# EAGLE design FAL65816_ram (EAGLE 7.2.0)
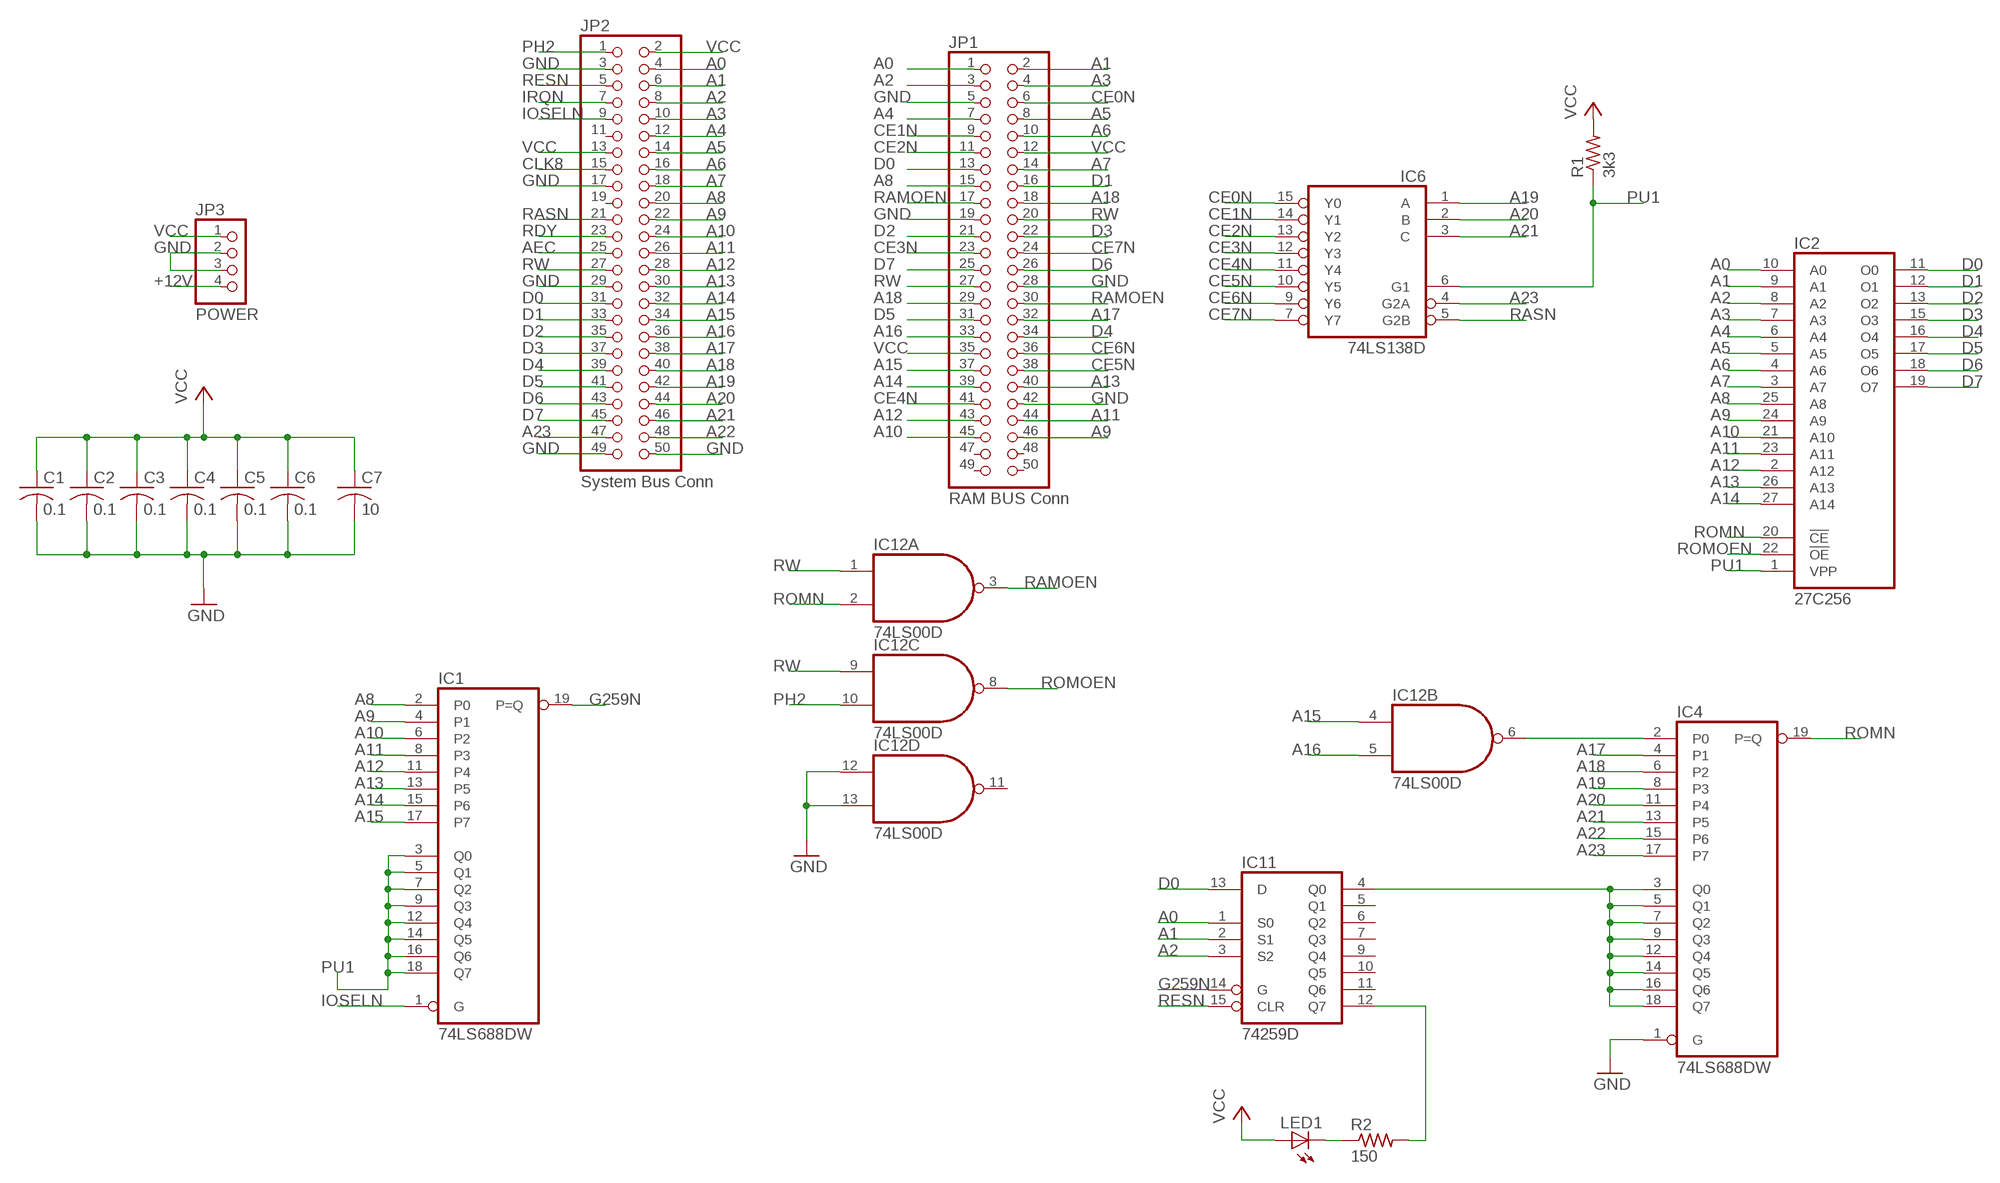
[diagram p0: schematic, sheet 1]

## Parts
C1  0.1  C-US050-024X044  [C050-024X044]
C2  0.1  C-US050-024X044  [C050-024X044]
C3  0.1  C-US050-024X044  [C050-024X044]
C4  0.1  C-US050-024X044  [C050-024X044]
C5  0.1  C-US050-024X044  [C050-024X044]
C6  0.1  C-US050-024X044  [C050-024X044]
C7  10  C-US050-024X044  [C050-024X044]
IC1  74LS688DW  [SO20W]
IC2  27C256  27256  [DIL28]
IC4  74LS688DW  [SO20W]
IC6  74LS138D  [SO16]
IC11  74259D  [SO16]
IC12  74LS00D  [SO14]
JP1  RAM BUS Conn  PINHD-2X25/90  [2X25/90]
JP2  System Bus Conn  PINHD-2X25/90  [2X25/90]
JP3  POWER  PINHD-1X4/90  [1X04/90]
LED1  LED5MM  [LED5MM]
R1  3k3  R-US_0204/7  [0204/7]
R2  150  R-US_0204/7  [0204/7]

## Nets
+12V: JP3.4
A0: IC2.10(A0) IC11.1(S0) JP1.1 JP2.4
A1: IC2.9(A1) IC11.2(S1) JP1.2 JP2.6
A2: IC2.8(A2) IC11.3(S2) JP1.3 JP2.8
A3: IC2.7(A3) JP1.4 JP2.10
A4: IC2.6(A4) JP1.7 JP2.12
A5: IC2.5(A5) JP1.8 JP2.14
A6: IC2.4(A6) JP1.10 JP2.16
A7: IC2.3(A7) JP1.14 JP2.18
A8: IC1.2(P0) IC2.25(A8) JP1.15 JP2.20
A9: IC1.4(P1) IC2.24(A9) JP1.46 JP2.22
A10: IC1.6(P2) IC2.21(A10) JP1.45 JP2.24
A11: IC1.8(P3) IC2.23(A11) JP1.44 JP2.26
A12: IC1.11(P4) IC2.2(A12) JP1.43 JP2.28
A13: IC1.13(P5) IC2.26(A13) JP1.40 JP2.30
A14: IC1.15(P6) IC2.27(A14) JP1.39 JP2.32
A15: IC1.17(P7) IC12.4(B:I0) JP1.37 JP2.34
A16: IC12.5(B:I1) JP1.33 JP2.36
A17: IC4.4(P1) JP1.32 JP2.38
A18: IC4.6(P2) JP1.18 JP1.29 JP2.40
A19: IC4.8(P3) IC6.1(A) JP2.42
A20: IC4.11(P4) IC6.2(B) JP2.44
A21: IC4.13(P5) IC6.3(C) JP2.46
A22: IC4.15(P6) JP2.48
A23: IC4.17(P7) IC6.4(G2A) JP2.47
AEC: JP2.25
CE0N: IC6.15(Y0) JP1.6
CE1N: IC6.14(Y1) JP1.9
CE2N: IC6.13(Y2) JP1.11
CE3N: IC6.12(Y3) JP1.23
CE4N: IC6.11(Y4) JP1.41
CE5N: IC6.10(Y5) JP1.38
CE6N: IC6.9(Y6) JP1.36
CE7N: IC6.7(Y7) JP1.24
CLK8: JP2.15
D0: IC2.11(O0) IC11.13(D) JP1.13 JP2.31
D1: IC2.12(O1) JP1.16 JP2.33
D2: IC2.13(O2) JP1.21 JP2.35
D3: IC2.15(O3) JP1.22 JP2.37
D4: IC2.16(O4) JP1.34 JP2.39
D5: IC2.17(O5) JP1.31 JP2.41
D6: IC2.18(O6) JP1.26 JP2.43
D7: IC2.19(O7) JP1.25 JP2.45
G259N: IC1.19(P=Q) IC11.14(G)
GND: C1.2 C2.2 C3.2 C4.2 C5.2 C6.2 C7.2 IC4.1(G) IC12.12(D:I0) IC12.13(D:I1) JP1.5 JP1.19 JP1.28 JP1.42 JP2.3 JP2.17 JP2.29 JP2.49 JP2.50 JP3.2 JP3.3
IOSELN: IC1.1(G) JP2.9
IRQN: JP2.7
N$1: IC4.3(Q0) IC4.5(Q1) IC4.7(Q2) IC4.9(Q3) IC4.12(Q4) IC4.14(Q5) IC4.16(Q6) IC4.18(Q7) IC11.4(Q0)
N$2: LED1.K(C) R2.1
N$3: IC11.12(Q7) R2.2
N$4: IC4.2(P0) IC12.6(B:O)
PH2: IC12.10(C:I1) JP2.1
PU1: IC1.3(Q0) IC1.5(Q1) IC1.7(Q2) IC1.9(Q3) IC1.12(Q4) IC1.14(Q5) IC1.16(Q6) IC1.18(Q7) IC2.1(VPP) IC6.6(G1) R1.1
RAMOEN: IC12.3(A:O) JP1.17 JP1.30
RASN: IC6.5(G2B) JP2.21
RDY: JP2.23
RESN: IC11.15(CLR) JP2.5
ROMN: IC2.20(!CE) IC4.19(P=Q) IC12.2(A:I1)
ROMOEN: IC2.22(!OE) IC12.8(C:O)
RW: IC12.1(A:I0) IC12.9(C:I0) JP1.20 JP1.27 JP2.27
VCC: C1.1 C2.1 C3.1 C4.1 C5.1 C6.1 C7.1 JP1.12 JP1.35 JP2.2 JP2.13 JP3.1 LED1.A R1.2
Unconnected: IC11.5(Q1) IC11.6(Q2) IC11.7(Q3) IC11.9(Q4) IC11.10(Q5) IC11.11(Q6) IC12.11(D:O) JP1.47 JP1.48 JP1.49 JP1.50 JP2.11 JP2.19

## Power pins joined to a net without a drawn wire
GND: IC1.10(GND) IC2.14(GND) IC4.10(GND) IC6.8(GND) IC11.8(GND) IC12.7(P:GND)
VCC: IC1.20(VCC) IC2.28(VCC) IC4.20(VCC) IC6.16(VCC) IC11.16(VCC) IC12.14(P:VCC)

## Library data of the parts
C1-C7 = rcl:C-US: CAPACITOR, American symbol
IC1 IC4 = FT74xx:74*688: 8-bit MAGNITUDE/IDENTITY COMPARATOR, totem pole
IC2 = memory:27256: MEMORY
IC6 = FT74xx:74*138: 3-line to 8-line DECODER/DEMULTIPLEXER
IC11 = 74xx-us:74*259: 8-bit addressable LATCH
IC12 = 74xx-us:74*00: Quad 2-input NAND gate
JP1 JP2 = pinhead:PINHD-2X25: PIN HEADER
JP3 = pinhead:PINHD-1X4: PIN HEADER
LED1 = led:LED: LED OSRAM: - CHIPLED LG R971, LG N971, LY N971, LG Q971, LY Q971, LO R971, LY R971 LH N974, LH R974 LS Q976, LO Q976, LY Q976 LO Q996 - Hyper CHIPLED LW Q18S LB Q993, LB Q99A, LB R99A - SideLED LS A670, LO A670, LY A670, LG A670, LP A670 LB A673, LV A673, LT A673, LW A673 LH A674 LY A675 LS A676, LA A676, LO A676, LY A676, LW A676 LS A679, LY A679, LG A679 - Hyper Micro SIDELED® LS Y876, LA Y876, LO Y876, LY Y876 LT Y87S - SmartLED LW L88C, LW L88S LB L89C, LB L89S, LG L890 LS L89K, LO L89K, LY L89K LS L896, LA L896, LO L896, LY L896 - TOPLED LS T670, LO T670, LY T670, LG T670, LP T670 LSG T670, LSP T670, LSY T670, LOP T670, LYG T670 LG T671, LOG T671, LSG T671 LB T673, LV T673, LT T673, LW T673 LH T674 LS T676, LA T676, LO T676, LY T676, LB T676, LH T676, LSB T676, LW T676 LB T67C, LV T67C, LT T67C, LS T67K, LO T67K, LY T67K, LW E67C LS E67B, LA E67B, LO E67B, LY E67B, LB E67C, LV E67C, LT E67C LW T67C LS T679, LY T679, LG T679 LS T770, LO T770, LY T770, LG T770, LP T770 LB T773, LV T773, LT T773, LW T773 LH T774 LS E675, LA E675, LY E675, LS T675 LS T776, LA T776, LO T776, LY T776, LB T776 LHGB T686 LT T68C, LB T68C - Hyper Mini TOPLED® LB M676 - Mini TOPLED Santana® LG M470 LS M47K, LO M47K, LY M47K Source: http://www.osram.convergy.de LUXEON: - LUMILED® LXK2-PW12-R00, LXK2-PW12-S00, LXK2-PW14-U00, LXK2-PW14-V00 LXK2-PM12-R00, LXK2-PM12-S00, LXK2-PM14-U00 LXK2-PE12-Q00, LXK2-PE12-R00, LXK2-PE12-S00, LXK2-PE14-T00, LXK2-PE14-U00 LXK2-PB12-K00, LXK2-PB12-L00, LXK2-PB12-M00, LXK2-PB14-N00, LXK2-PB14-P00, LXK2-PB14-Q00 LXK2-PR12-L00, LXK2-PR12-M00, LXK2-PR14-Q00, LXK2-PR14-R00 LXK2-PD12-Q00, LXK2-PD12-R00, LXK2-PD12-S00 LXK2-PH12-R00, LXK2-PH12-S00 LXK2-PL12-P00, LXK2-PL12-Q00, LXK2-PL12-R00 Source: www.luxeon.com KINGBRIGHT: KA-3528ASYC Source: www.kingbright.com
R1 R2 = resistor:R-US_: RESISTOR, American symbol

## Board
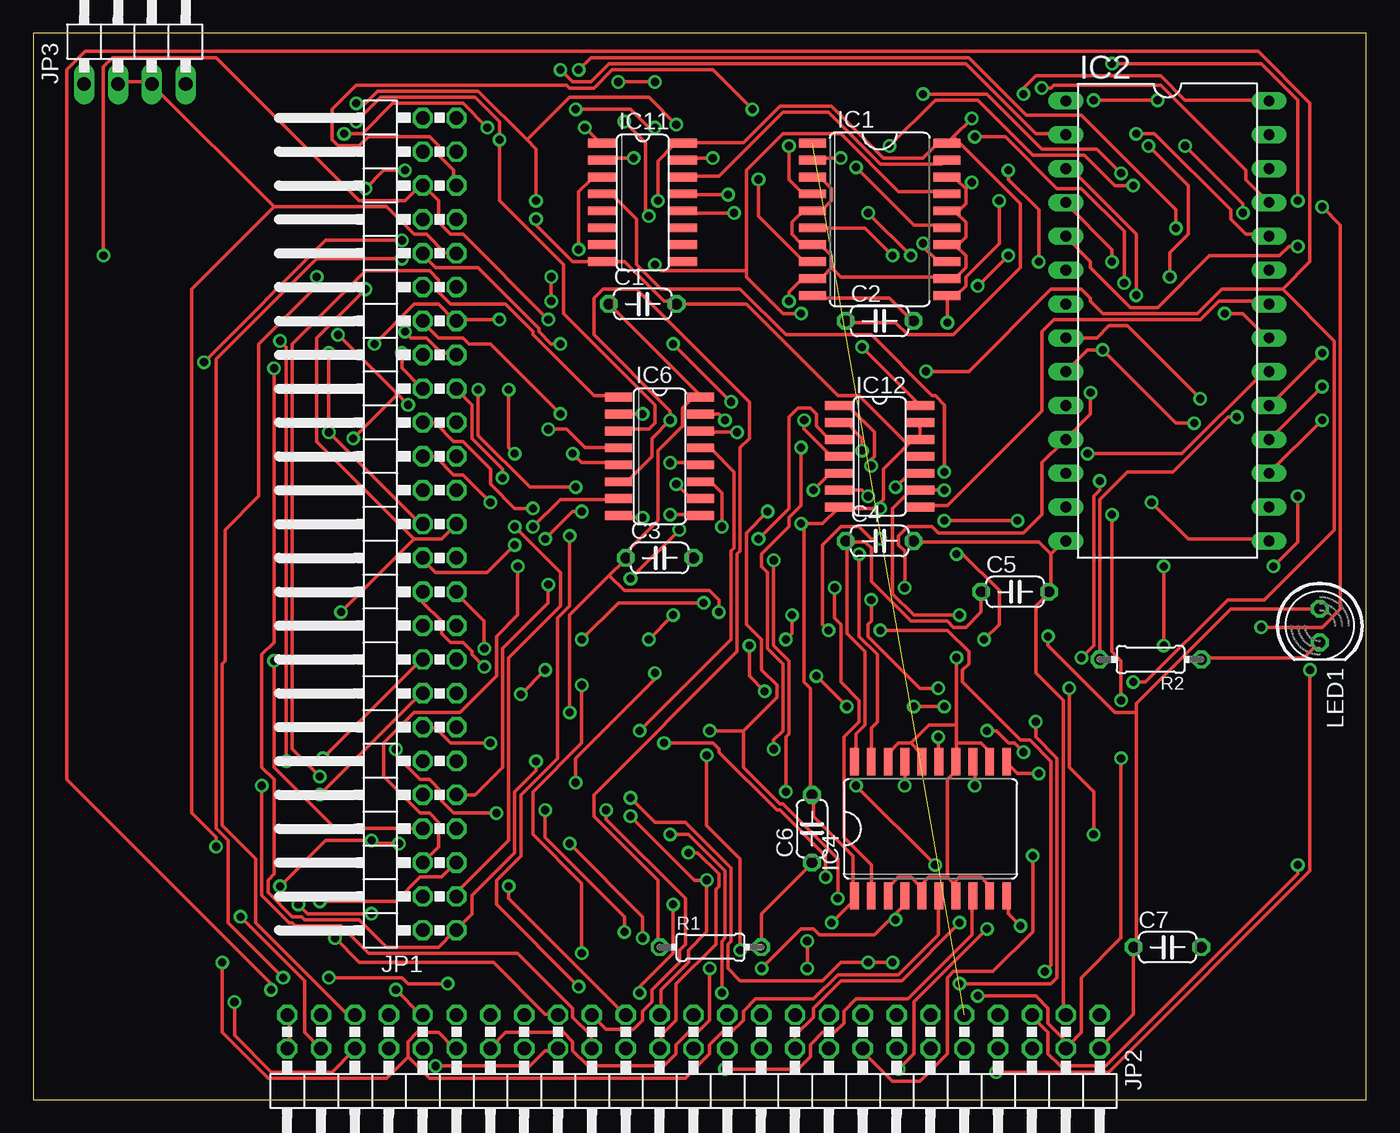
[diagram p1: board, top side]
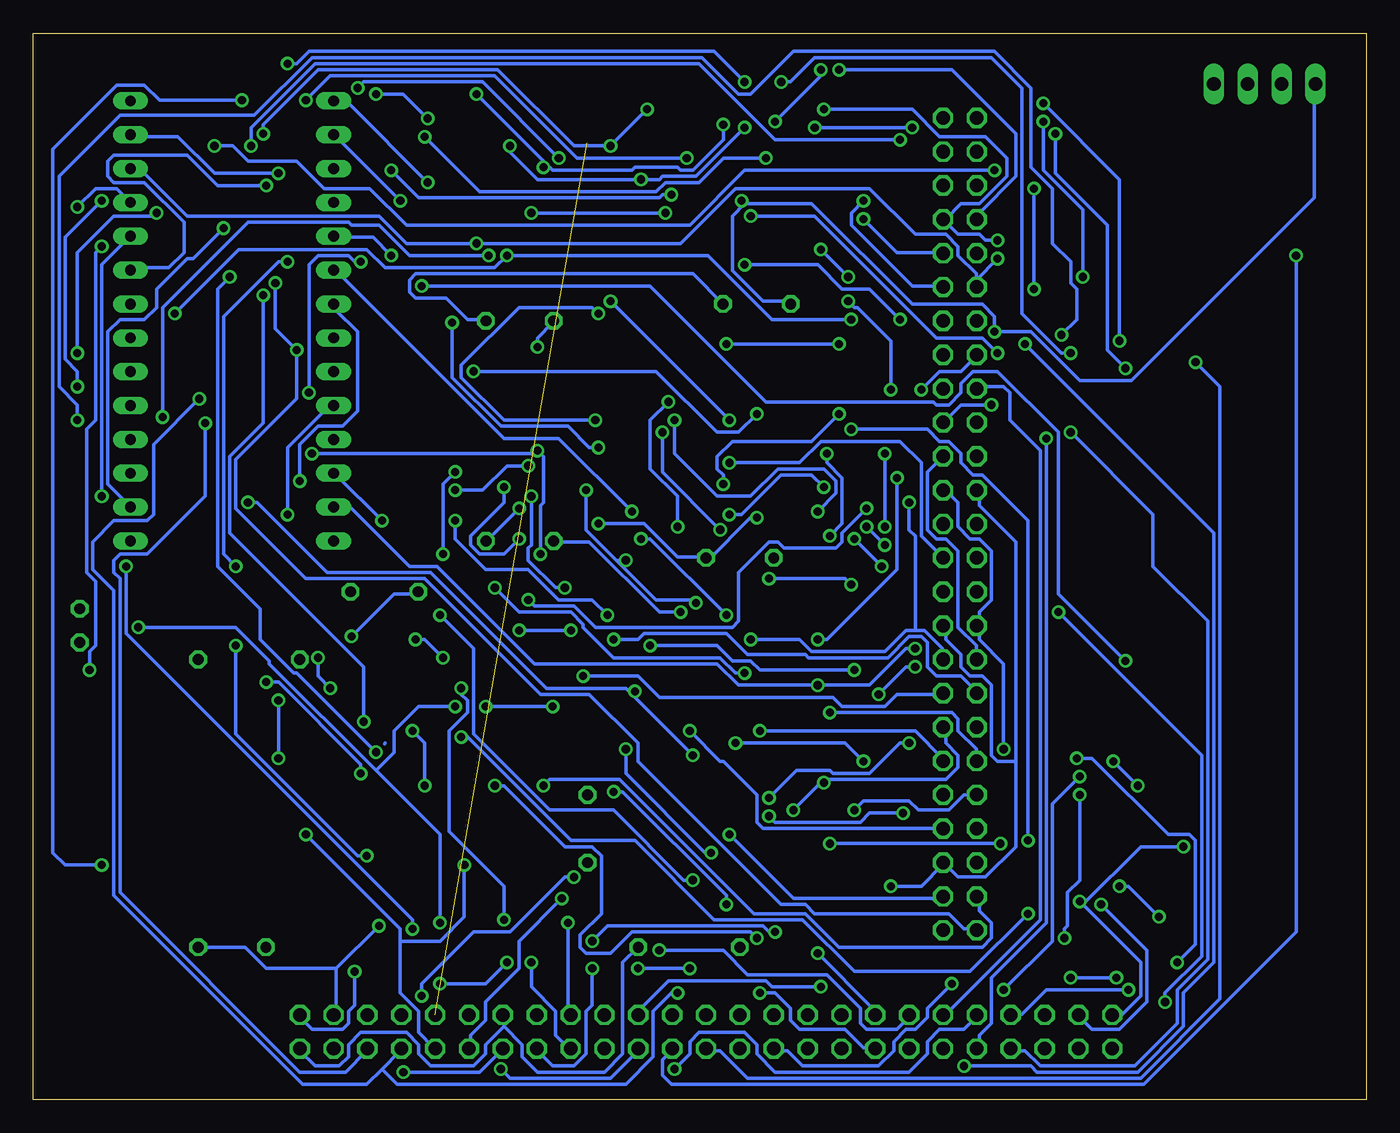
[diagram p2: board, bottom side, seen from below]

Size 100 x 80 mm. Coordinates in mm from the lower left corner, seen from the top.
Outline: 0,0 100,0 100,80 0,80 0,0
Copper layers (1*16): Top 0.035mm / dielectric 1.5mm / Bottom 0.035mm
Design rules "default": minimum track width 10mil, minimum drill 24mil, track to track 8mil, track to pad 8mil, pad to pad 8mil, via to via 8mil, smd to smd 8mil, copper to edge 40mil, drill to drill 8mil, minimum pad ring 10mil, minimum via ring 8mil, stop-mask expansion 4mil, vias tented up to drill 0mil, thermal gap 10mil

### Footprints (pad centres in the part's own frame; a part is rotated, then mirrored left to right if it is on the bottom)
C050-024X044 = drill 0.813 octagon: 1 -2.54,0; 2 2.54,0
SO20W = smd 0.66 x 2.032: 1 -5.715,-5.029; 2 -4.445,-5.029; 3 -3.175,-5.029; 4 -1.905,-5.029; 5 -0.635,-5.029; 6 0.635,-5.029; 7 1.905,-5.029; 8 3.175,-5.029; 9 4.445,-5.029; 10 5.715,-5.029; 11 5.715,5.029; 12 4.445,5.029; 13 3.175,5.029; 14 1.905,5.029; 15 0.635,5.029; 16 -0.635,5.029; 17 -1.905,5.029; 18 -3.175,5.029; 19 -4.445,5.029; 20 -5.715,5.029
DIL28 = drill 0.813 long: 1 -16.51,-7.62; 2 -13.97,-7.62; 3 -11.43,-7.62; 4 -8.89,-7.62; 5 -6.35,-7.62; 6 -3.81,-7.62; 7 -1.27,-7.62; 8 1.27,-7.62; 9 3.81,-7.62; 10 6.35,-7.62; 11 8.89,-7.62; 12 11.43,-7.62; 13 13.97,-7.62; 14 16.51,-7.62; 15 16.51,7.62; 16 13.97,7.62; 17 11.43,7.62; 18 8.89,7.62; 19 6.35,7.62; 20 3.81,7.62; 21 1.27,7.62; 22 -1.27,7.62; 23 -3.81,7.62; 24 -6.35,7.62; 25 -8.89,7.62; 26 -11.43,7.62; 27 -13.97,7.62; 28 -16.51,7.62
SO16 = smd 0.66 x 2.032: 1 -4.445,-3.073; 2 -3.175,-3.073; 3 -1.905,-3.073; 4 -0.635,-3.073; 5 0.635,-3.073; 6 1.905,-3.073; 7 3.175,-3.073; 8 4.445,-3.073; 9 4.445,3.073; 10 3.175,3.073; 11 1.905,3.073; 12 0.635,3.073; 13 -0.635,3.073; 14 -1.905,3.073; 15 -3.175,3.073; 16 -4.445,3.073
SO14 = smd 0.66 x 2.032: 1 -3.81,-3.073; 2 -2.54,-3.073; 3 -1.27,-3.073; 4 0,-3.073; 5 1.27,-3.073; 6 2.54,-3.073; 7 3.81,-3.073; 8 3.81,3.073; 9 2.54,3.073; 10 1.27,3.073; 11 0,3.073; 12 -1.27,3.073; 13 -2.54,3.073; 14 -3.81,3.073
2X25/90 = drill 1.016 octagon: 1 -29.21,-6.35; 2 -29.21,-3.81; 3 -26.67,-6.35; 4 -26.67,-3.81; 5 -24.13,-6.35; 6 -24.13,-3.81; 7 -21.59,-6.35; 8 -21.59,-3.81; 9 -19.05,-6.35; 10 -19.05,-3.81; 11 -16.51,-6.35; 12 -16.51,-3.81; 13 -13.97,-6.35; 14 -13.97,-3.81; 15 -11.43,-6.35; 16 -11.43,-3.81; 17 -8.89,-6.35; 18 -8.89,-3.81; 19 -6.35,-6.35; 20 -6.35,-3.81; 21 -3.81,-6.35; 22 -3.81,-3.81; 23 -1.27,-6.35; 24 -1.27,-3.81; 25 1.27,-6.35; 26 1.27,-3.81; 27 3.81,-6.35; 28 3.81,-3.81; 29 6.35,-6.35; 30 6.35,-3.81; 31 8.89,-6.35; 32 8.89,-3.81; 33 11.43,-6.35; 34 11.43,-3.81; 35 13.97,-6.35; 36 13.97,-3.81; 37 16.51,-6.35; 38 16.51,-3.81; 39 19.05,-6.35; 40 19.05,-3.81; 41 21.59,-3.81; 42 21.59,-6.35; 43 24.13,-3.81; 44 24.13,-6.35; 45 26.67,-3.81; 46 26.67,-6.35; 47 29.21,-3.81; 48 29.21,-6.35; 49 31.75,-3.81; 50 31.75,-6.35
1X04/90 = drill 1.016 long: 1 -3.81,-3.81; 2 -1.27,-3.81; 3 1.27,-3.81; 4 3.81,-3.81
LED5MM = drill 0.813 octagon: A -1.27,0; K 1.27,0
0204/7 = drill 0.813 octagon: 1 -3.81,0; 2 3.81,0

### Placement (x,y rotation side)
C1  45.72,59.69 0 top
C2  63.5,58.42 0 top
C3  46.99,40.64 0 top
C4  63.5,41.91 0 top
C5  73.66,38.1 0 top
C6  58.42,20.32 90 top
C7  85.09,11.43 0 top
IC1  63.5,66.04 270 top
IC2  85.09,58.42 270 top
IC4  67.31,20.32 0 top
IC6  46.99,48.26 270 top
IC11  45.72,67.31 270 top
IC12  63.5,48.26 270 top
JP1  25.4,41.91 90 top
JP2  50.8,0 180 top
JP3  7.62,80.01 0 top
LED1  96.52,35.56 270 top
R1  50.8,11.43 0 top
R2  83.82,33.02 180 top

### Tracks (layer width: path | path; a pad name or v marks a point on that pad's centre or on a via)
A0  (via drill 0.61)
  Top 0.254: v80.92,43.89 80.92,33.6 81.61,32.92 v81.61,29.95 | v81.61,25.6 81.61,12.12 78.64,9.14 78.64,5.03 77.72,4.12 | 77.72,4.12 77.5,3.89 JP2.4 77.72,4.12 | v41.38,72.92 42.52,71.78 IC11.1 | v34.06,72.92 32.23,74.75 26.98,74.75 24.69,72.47 v23.32,72.47 | v18.06,54.86 18.06,34.29 17.14,33.38 17.14,24.92 18.06,24 18.06,16.92 17.6,16.46 17.6,15.54 19.43,13.72 20.12,13.72 20.34,13.49 24.46,13.49 26.52,11.43 30.4,11.43 31.55,12.57 JP1.1 31.77,12.8 32.92,13.95 32.92,15.32 36.12,18.52 36.12,23.09 37.72,24.69 v37.72,25.38 | 77.72,4.12 76.12,5.71 76.12,6.86 75.21,7.77 v70.87,7.77 | v59.44,16.69 59.44,18.29 56.01,21.72 55.78,21.72 51.44,26.06 51.44,26.29 50.98,26.75 v47.32,26.75
  Bottom 0.254: v80.92,43.89 80.92,48.92 77.95,51.89 77.5,51.89 IC2.10 | v81.61,25.6 v81.61,29.95 | v34.06,72.92 v41.38,72.92 | v23.32,72.47 23.32,69.49 19.43,65.61 19.43,56.24 v18.06,54.86 | v70.87,7.77 70.87,8.69 66.98,12.57 64.24,12.57 60.12,16.69 v59.44,16.69 | v47.32,26.75 39.09,26.75 v37.72,25.38
A1  (via drill 0.61)
  Top 0.254: v45.03,70.64 42.75,70.64 IC11.2 | v70.64,72.24 72.92,72.24 76.81,68.35 78.64,68.35 81.84,65.15 v81.84,61.27 | IC2.9 79.1,56.24 v80.24,56.24 85.72,50.75 v87.1,50.75
  Bottom 0.254: v45.03,70.64 48.23,70.64 50.06,68.81 52.58,68.81 53.26,68.12 66.52,68.12 v70.64,72.24 | v81.84,61.27 81.84,57.84 v80.24,56.24 80.24,52.58 84.81,48.01 84.81,44.35 79.55,39.09 70.64,39.09 61.95,30.4 58.29,30.4 54.63,26.75 54.63,25.38 43.89,14.63 42.06,14.63 41.38,13.95 31.32,13.95 30.18,12.8 29.26,12.8 JP1.2 | v87.1,50.75 87.1,45.26 91.44,40.92 93.5,40.92 93.95,40.46 93.95,39.55 93.5,39.09 93.5,15.54 80.01,2.06 76.58,2.06 74.98,3.66 JP2.6
A2  (via drill 0.61)
  Top 0.254: v40.92,63.78 40.92,68.12 41.83,69.04 42.52,69.04 IC11.3 | v38.86,59.89 v38.86,61.72 | v35.66,53.26 35.66,48.92 v36.12,48.46 | v36.12,42.98 39.55,39.55 39.55,37.03 35.66,33.15 35.66,19.43 31.55,15.32 JP1.3 | IC2.8 79.78,57.15 80.7,58.06 82.07,58.06 v87.55,52.58 | v47.78,19.89 49.15,19.89 51.89,17.14 51.89,12.12 51.66,11.89 v51.66,8
  Bottom 0.254: v38.86,61.72 v40.92,63.78 | v38.86,59.89 38.41,59.44 38.18,59.44 35.66,56.92 v35.66,53.26 | v36.12,42.98 v36.12,48.46 | v87.55,52.58 90.98,49.15 90.98,43.89 91.44,43.43 93.95,43.43 95.56,41.83 95.56,39.78 93.95,38.18 93.95,15.32 79.78,1.14 74.98,1.14 73.84,2.29 | 73.84,2.29 72.47,3.66 JP2.8 | v47.78,19.89 42.98,15.09 31.77,15.09 JP1.3 | v51.66,8 52.12,8 53.49,6.63 53.49,3.2 55.55,1.14 72.69,1.14 73.84,2.29
A3  (via drill 0.61)
  Top 0.254: v80.01,46.41 80.01,45.72 79.55,45.26 79.55,34.06 v78.64,33.15 | v77.72,30.86 77.72,24.92 79.55,23.09 v79.55,19.89 | v67.67,17.6 v61.72,23.55
  Bottom 0.254: v80.01,46.41 80.01,49.15 78.64,50.52 76.81,50.52 75.67,51.66 75.67,57.61 77.27,59.21 77.27,59.66 IC2.7 | v78.64,33.15 78.64,31.77 v77.72,30.86 | v79.55,19.89 72.47,12.8 72.47,11.89 | 72.47,11.89 72.47,8 71.09,6.63 71.09,5.03 69.95,3.89 JP2.10 | v61.72,23.55 61.27,24 56.01,24 45.95,13.95 42.06,13.95 39.55,11.43 28.8,11.43 28.12,12.12 28.12,13.26 29.03,14.17 29.03,15.09 JP1.4 | v67.67,17.6 67.67,13.72 69.49,11.89 72.47,11.89
A4  (via drill 0.61)
  Top 0.254: v55.09,44.12 53.49,42.52 53.49,35.66 54.63,34.52 54.63,32.23 55.78,31.09 55.78,30.18 53.26,27.66 | v50.75,27.66 53.26,27.66 | v60.35,15.09 60.35,18.06 56.24,22.17 56.01,22.17 53.26,24.92 53.26,27.66
  Bottom 0.254: v55.09,44.12 60.58,49.61 64.69,49.61 77.27,62.18 IC2.6 | v50.75,27.66 48.46,25.38 48.23,25.38 45.72,22.86 45.72,20.8 45.26,20.34 31.77,20.34 JP1.7 | v60.35,15.09 63.55,11.89 63.55,9.83 66.06,7.32 66.06,5.94 67.21,4.8 67.21,3.89 JP2.12
A5  (via drill 0.61)
  Top 0.254: v70.87,61.04 v73.15,63.32 | v18.06,32.92 18.06,24.92 22.63,20.34 29.03,20.34 JP1.8 | v72.24,2.06 80.7,2.06 95.78,17.14 v95.78,32.23 | v94.87,64.01 94.18,64.01 93.5,63.32 88.24,63.32 84.35,59.44 82.3,59.44 79.32,62.41 79.32,62.87 77.5,64.69 IC2.5
  Bottom 0.254: v73.15,63.32 74.52,64.69 77.27,64.69 IC2.5 | v70.87,61.04 53.72,61.04 45.03,52.35 32.46,52.35 32.23,52.12 31.32,52.12 30.4,53.03 30.4,53.72 29.49,54.63 27.66,54.63 23.09,50.06 23.09,37.95 v18.06,32.92 | JP2.14 66.52,2.06 v72.24,2.06 | v95.78,32.23 95.78,33.6 95.33,34.06 95.33,38.86 96.01,39.55 96.01,50.29 95.33,50.98 95.33,63.55 v94.87,64.01
A6  (via drill 0.61)
  Top 0.254: v80.92,62.87 80.92,63.78 77.5,67.21 IC2.4 | v84.81,34.06 v84.81,40.01 | v74.98,18.29 74.98,12.57 72.01,9.6 69.04,9.6 68.58,9.14 68.58,3.43 66.52,1.37 64.47,1.37 62.18,3.66 JP2.16 | v38.41,21.72 38.41,19.66 44.35,13.72 v44.35,12.57 | v58.06,9.83 v58.06,11.89
  Bottom 0.254: v80.92,62.87 81.61,62.87 85.72,58.75 85.72,40.92 v84.81,40.01 | v84.81,34.06 84.81,27.43 75.67,18.29 v74.98,18.29 | JP1.10 30.18,22.86 31.32,21.72 33.6,21.72 34.29,22.4 37.72,22.4 v38.41,21.72 | v44.35,12.57 44.81,12.57 45.26,13.03 56.92,13.03 v58.06,11.89 | v58.06,9.83 58.06,7.09 58.52,6.63 58.52,3.43 59.44,2.52 61.04,2.52 62.18,3.66 JP2.16
A7  (via drill 0.61)
  Top 0.254: v82.75,60.35 82.75,64.92 77.95,69.72 77.5,69.72 IC2.3 | v75.21,28.35 75.21,27.2 76.81,25.6 76.81,9.14 76.35,8.69 v69.49,8.69 | v64.47,10.29 v62.64,10.29 60.58,10.29 59.21,8.91 53.03,8.91 52.12,9.83 52.12,11.66 52.35,11.89 52.35,17.37 48.92,20.8 46.63,20.8 v44.81,22.63 | v34.29,26.75 31.32,26.75 30.18,27.89 29.26,27.89 JP1.14
  Bottom 0.254: v82.75,60.35 82.75,50.75 85.27,48.23 85.27,42.52 75.21,32.46 v75.21,28.35 | v69.49,8.69 66.06,8.69 v64.47,10.29 | v62.64,10.29 62.64,8.46 60.81,6.63 60.81,4.8 59.89,3.89 JP2.18 | v34.29,26.75 34.98,26.75 37.26,24.46 40.01,24.46 40.23,24.69 42.75,24.69 v44.81,22.63
A8  (via drill 0.61)
  Top 0.254: v60.58,70.64 58.52,70.64 IC1.2 | v75.67,75.89 76.35,75.89 76.58,76.12 84.58,76.12 90.98,69.72 90.98,69.04 IC2.25 | JP2.20 57.15,4.8 58.52,6.17 58.52,6.86 60.58,8.91 65.15,8.91 v69.49,13.26 | v92.13,35.43 96.7,35.43 98.07,36.8 98.07,65.61 v96.7,66.98 | v61.04,29.49 v58.75,31.77 | v68.35,29.49 v66.06,29.49
  Bottom 0.254: v60.58,70.64 66.29,76.35 75.21,76.35 v75.67,75.89 | v69.49,13.26 69.49,19.89 74.3,24.69 | 74.3,24.69 82.3,32.69 82.3,32.92 84.81,35.43 v92.13,35.43 | v96.7,66.98 95.33,68.35 93.73,68.35 92.81,67.44 IC2.25 | v58.75,31.77 54.63,31.77 53.03,30.18 40.01,30.18 39.32,29.49 36.12,29.49 35.2,30.4 31.77,30.4 JP1.15 | v66.06,29.49 v61.04,29.49 | v68.35,29.49 71.09,29.49 72.92,27.66 72.92,26.06 74.3,24.69
A9  (via drill 0.61)
  Top 0.254: v56.69,71.55 56.69,69.04 57.61,68.12 58.29,68.12 IC1.4 | v82.75,72.47 84.12,72.47 89.84,66.75 89.84,66.06 90.98,64.92 92.58,64.92 IC2.24 | v64.92,2.29 66.06,3.43 66.06,7.32 v71.55,12.8 | v93.04,40.01 94.87,41.83 v94.87,45.26 | v53.95,74.3 50.98,77.27 43.43,77.27 42.06,75.89 40.23,75.89 40.01,76.12 24.23,76.12 22.4,74.3 22.4,72.01 22.86,71.55 24.46,71.55 25.15,72.24 29.72,72.24 30.4,71.55 30.4,70.87 31.55,69.72 31.55,68.58 JP1.46
  Bottom 0.254: v82.75,72.47 82.75,73.15 78.64,77.27 65.15,77.27 59.44,71.55 v56.69,71.55 v53.95,74.3 | v64.92,2.29 64.24,1.6 56.69,1.6 54.63,3.66 JP2.22 | v71.55,12.8 71.55,13.49 93.04,34.98 v93.04,40.01 | v94.87,45.26 94.87,62.64 92.81,64.69 IC2.24
A10  (via drill 0.61)
  Top 0.254: v64.47,63.32 62.41,65.38 58.52,65.38 IC1.6 | v89.38,58.98 90.75,58.98 92.58,57.15 IC2.21 | v5.26,63.32 5.26,77.5 5.94,78.18 13.72,78.18 24.46,67.44 27.89,67.44 29.03,68.58 JP1.45 29.26,68.58 30.4,67.44 30.4,65.84 31.32,64.92 32.23,64.92 v38.63,58.52
  Bottom 0.254: v89.38,58.98 84.58,63.78 74.98,63.78 73.61,62.41 65.38,62.41 v64.47,63.32 49.38,63.32 44.58,58.52 v38.63,58.52 | v5.26,63.32 5.26,12.57 16.69,1.14 52.12,1.14 52.81,1.83 52.81,2.97 52.12,3.66 JP2.24
A11  (via drill 0.61)
  Top 0.254: IC1.8 57.84,62.87 54.41,66.29 v54.41,69.04 | v46.63,72.92 46.18,72.92 44.81,74.3 v40.69,74.3 | v82.53,68.58 81.15,68.58 78.87,70.87 74.98,70.87 70.87,74.98 67.67,74.98 v64.24,71.55 | v12.8,55.32 21.95,64.47 v27.66,64.47
  Bottom 0.254: v46.63,72.92 50.29,69.27 52.81,69.27 53.03,69.04 v54.41,69.04 62.18,69.04 64.24,71.09 v64.24,71.55 | v40.69,74.3 34.06,74.3 32,72.24 28.57,72.24 26.98,70.64 26.98,69.27 29.03,67.21 30.4,67.21 31.55,66.06 JP1.44 30.63,64.92 29.03,64.92 28.57,64.47 v27.66,64.47 | v82.53,68.58 86.18,68.58 88.47,70.87 93.95,70.87 94.41,70.41 94.41,69.27 93.95,68.81 91.67,68.81 88.7,65.84 88.7,63.55 89.84,62.41 92.58,62.41 IC2.23 | v12.8,55.32 10.97,53.49 10.97,7.54 16.92,1.6 46.41,1.6 48.46,3.66 49.38,3.66 JP2.26
A12  (via drill 0.61)
  Top 0.254: v72.47,67.44 72.47,64.24 69.95,61.72 69.95,61.04 69.27,60.35 68.58,60.35 IC1.11 68.58,60.12 v68.58,58.29 | v49.15,18.52 49.84,18.52 51.44,16.92 51.44,16 51.21,15.77 51.21,11.66 48.23,8.69 48.23,5.94 47.09,4.8 47.09,3.89 JP2.28 | v55.55,26.29 55.55,26.98 56.24,27.66 56.24,32.69 55.09,33.83 55.09,39.55 54.63,40.01 54.63,40.92 56.69,42.98 56.69,43.66 57.61,44.58 v57.61,48.92 | v39.55,77.27 40.46,76.35 41.83,76.35 43.2,77.72 69.95,77.72 75.21,72.47 77.27,72.47 IC2.2
  Bottom 0.254: v72.47,67.44 77.27,72.24 IC2.2 | v49.15,18.52 49.61,18.52 55.55,24.46 v55.55,26.29 | v57.61,48.92 58.29,48.92 59.89,50.52 64.92,50.52 68.58,54.18 v68.58,58.29 | v39.55,77.27 31.09,77.27 26.29,72.47 26.29,69.27 29.03,66.52 29.03,66.06 JP1.43
A13  (via drill 0.61)
  Top 0.254: IC1.13 67.89,62.87 66.75,64.01 v66.75,64.24 | v31.09,8.69 28.12,8.69 27.66,9.14 v22.17,9.14 | v18.75,9.14 14.63,13.26 14.63,19.43 13.72,20.34 13.72,55.55 21.26,63.09 v27.66,63.09
  Bottom 0.254: IC2.26 92.58,69.72 91.9,69.72 88.47,66.29 74.07,66.29 72.01,64.24 v66.75,64.24 51.44,64.24 47.32,68.35 37.26,68.35 33.83,64.92 31.55,64.92 30.63,64.01 30.63,63.32 29.26,61.95 29.26,61.49 | 29.26,61.49 29.26,61.04 JP1.40 29.26,61.49 | v31.09,8.69 32.92,6.86 32.92,6.17 33.83,5.26 34.52,5.26 35.43,4.34 35.43,3.66 36.58,2.52 42.29,2.52 43.43,3.66 44.35,3.66 JP2.30 | v18.75,9.14 v22.17,9.14 | 29.26,61.49 v27.66,63.09
A14  (via drill 0.61)
  Top 0.254: v61.72,69.95 66.06,65.61 68.35,65.61 IC1.15 | v66.75,75.44 71.55,75.44 75.67,71.32 79.78,71.32 v81.61,69.49 | v17.14,23.55 17.14,15.32 19.2,13.26 19.43,13.26 19.66,13.03 23.09,13.03 25.15,10.97 36.35,10.97 40.46,6.86 40.46,6.17 41.83,4.8 41.83,3.89 JP2.32 | v18.97,25.38 18.97,56.46 v18.52,56.92 | v24.23,74.75 24.92,74.75 25.83,75.67 33.38,75.67 37.03,72.01 | 37.03,72.01 37.72,71.32 v37.72,67.44 | v48.23,73.15 46.18,75.21 40.23,75.21 37.03,72.01
  Bottom 0.254: v66.75,75.44 61.72,70.41 v61.72,69.95 61.27,69.95 61.04,69.72 55.09,69.72 54.86,69.95 51.66,69.95 51.44,69.72 50.52,69.72 48.23,72.01 v48.23,73.15 | v81.61,69.49 86.41,69.49 89.15,72.24 92.58,72.24 IC2.27 | v18.97,25.38 v17.14,23.55 | v18.52,56.92 18.52,69.04 v24.23,74.75 | v37.72,67.44 38.63,66.52 38.63,65.61 34.06,61.04 31.77,61.04 JP1.39
A15  (via drill 0.61)
  Top 0.254: v57.84,50.98 57.84,50.29 59.66,48.46 60.35,48.46 IC12.4 | v57.61,58.98 56.24,58.98 53.49,61.72 53.49,62.18 | 53.49,62.18 53.49,69.72 56.24,72.47 60.58,72.47 64.92,68.12 68.35,68.12 IC1.17 | v30.18,2.52 37.26,2.52 38.41,3.66 39.32,3.66 JP2.34 | v25.6,56.69 28.57,59.66 30.4,59.66 31.55,58.52 JP1.37 31.77,58.52 v34.98,58.52 | 53.49,62.18 47.09,62.18 v46.63,62.64
  Bottom 0.254: v57.84,50.98 64.69,50.98 67.89,54.18 67.89,55.09 63.55,59.44 58.06,59.44 v57.61,58.98 | v30.18,2.52 25.15,2.52 24.69,2.06 17.14,2.06 13.72,5.49 13.72,8 11.43,10.29 11.43,42.52 v25.6,56.69 | v46.63,62.64 41.15,62.64 39.32,60.81 37.26,60.81 v34.98,58.52
A16  (via drill 0.61)
  Top 0.254: v58.52,45.72 59.66,46.86 60.35,46.86 IC12.5 | v50.29,37.26 43.89,37.26 v41.15,34.52 | v35.2,46.63 35.2,47.32 32.92,49.61 32.92,52.12 31.77,53.26 JP1.33 | v45.49,8 45.49,8.46 48.01,10.97 v48.01,14.63 | v56.46,23.09 56.46,27.2 56.69,27.43 56.69,32.92 55.55,34.06 v55.55,40.46
  Bottom 0.254: v58.52,45.72 58.52,42.75 56.24,40.46 | 56.24,40.46 53.26,37.49 50.52,37.49 v50.29,37.26 | v41.15,34.52 40.46,34.52 35.2,39.78 v35.2,46.63 | v45.49,8 44.35,8 43.2,6.86 43.2,5.94 42.52,5.26 39.09,5.26 37.72,3.89 37.03,3.89 JP2.36 | v48.01,14.63 48.01,15.32 55.78,23.09 v56.46,23.09 | 56.24,40.46 v55.55,40.46
A17  (via drill 0.61)
  Top 0.254: 64.47,13.72 63.09,12.34 58.98,12.34 58.52,12.8 57.61,12.8 v54.63,9.83 | 64.47,13.72 65.38,14.63 65.38,15.09 IC4.4 | v50.75,9.83 50.75,5.94 49.84,5.03 49.15,5.03 48.23,4.12 48.23,3.43 47.32,2.52 41.6,2.52 40.46,3.66 40.46,4.34 39.78,5.03 35.43,5.03 34.29,3.89 JP2.38 | v37.49,44.35 36.12,44.35 34.29,46.18 34.29,47.32 32.23,49.38 31.55,49.38 30.18,50.75 29.26,50.75 JP1.32 | v62.87,37.49 62.87,35.89 62.64,35.66 62.64,34.75 66.52,30.86 v67.89,30.86 | 64.47,13.72 v64.69,13.49
  Bottom 0.254: v50.75,9.83 v54.63,9.83 | v37.49,44.35 39.32,42.52 39.32,41.83 39.78,41.38 43.66,41.38 44.12,41.83 44.81,41.83 47.09,39.55 47.09,35.89 47.55,35.43 57.84,35.43 59.44,37.03 62.41,37.03 v62.87,37.49 | v67.89,30.86 67.89,30.4 67.44,29.95 67.44,29.03 68.81,27.66 68.81,20.12 64.69,16 v64.69,13.49
A18  (via drill 0.61)
  Top 0.254: 28.12,3.2 29.72,1.6 48.92,1.6 50.75,3.43 50.75,4.12 51.66,5.03 52.35,5.03 53.26,5.94 53.26,6.63 54.18,7.54 58.52,7.54 60.35,9.37 64.92,9.37 67.89,12.34 67.89,15.09 IC4.6 | 28.12,3.2 28.12,4.34 28.8,5.03 30.4,5.03 31.55,3.89 JP2.40 | v21.72,25.6 29.03,32.92 JP1.18 | v14.17,10.29 14.17,5.03 17.6,1.6 26.52,1.6 28.12,3.2
  Bottom 0.254: JP1.29 32.92,47.09 32.92,42.75 32.23,42.06 31.55,42.06 30.63,41.15 30.63,35.43 29.26,34.06 29.26,33.15 JP1.18 | v21.72,25.6 20.57,25.6 14.86,19.89 13.26,19.89 12.8,19.43 12.8,11.66 v14.17,10.29
A19  (via drill 0.61)
  Top 0.254: v51.89,2.29 57.38,2.29 58.29,3.2 58.29,4.12 59.21,5.03 60.12,5.03 60.81,5.71 60.81,6.63 61.72,7.54 65.61,7.54 70.41,12.34 70.41,15.09 IC4.8 | v21.49,24.23 19.43,26.29 19.43,56.69 24.92,62.18 29.72,62.18 30.4,61.49 30.4,60.58 31.32,59.66 35.43,59.66 37.49,57.61 37.49,57.38 42.06,52.81 43.89,52.81 IC6.1 | v27.2,8.23 29.03,6.4 JP2.42
  Bottom 0.254: v51.89,2.29 50.75,3.43 50.75,4.34 50.06,5.03 46.63,5.03 45.72,4.12 45.72,3.43 44.35,2.06 34.29,2.06 32.92,3.43 32.92,4.34 32,5.26 30.18,5.26 29.26,6.17 JP2.42 | v21.49,24.23 23.55,22.17 23.55,11.89 v27.2,8.23
A20  (via drill 0.61)
  Top 0.254: v45.72,51.44 IC6.2 | v66.98,54.63 70.18,54.63 76.35,60.81 78.64,60.81 79.32,60.12 79.32,59.89 80.24,58.98 87.33,58.98 89.15,60.81 93.73,60.81 | 93.73,60.81 97.61,56.92 97.61,42.75 92.35,37.49 89.61,37.49 83.44,31.32 v82.53,31.32 | v75.44,24.46 73.84,24.46 73.15,25.15 IC4.11 | v17.83,8.23 17.83,8.69 2.52,24 2.52,77.27 3.89,78.64 91.9,78.64 95.78,74.75 95.78,62.87 93.73,60.81
  Bottom 0.254: v45.72,51.44 47.09,50.06 48.69,50.06 53.26,54.63 v66.98,54.63 | v82.53,31.32 81.61,31.32 75.44,25.15 v75.44,24.46 | v17.83,8.23 24,8.23 25.83,6.4 26.52,6.4 JP2.44
A21  (via drill 0.61)
  Top 0.254: v24.23,73.38 26.06,75.21 33.15,75.21 34.98,73.38 v34.98,72.01 34.98,67.44 39.78,62.64 39.78,58.98 46.63,52.12 46.63,50.75 46.18,50.29 44.12,50.29 IC6.3 | v21.26,61.72 21.26,61.04 16.92,56.69 16.92,45.26 14.4,42.75 14.4,32.92 14.17,32.69 14.17,20.57 16.69,18.06 16.69,13.26 23.55,6.4 24,6.4 JP2.46 | v70.64,23.55 70.64,25.15 IC4.13 | v71.55,27.66 72.24,27.66 73.15,26.75 73.61,26.75 v74.3,26.06 | v85.27,61.72 85.27,63.55 86.64,64.92 86.64,68.58 v83.67,71.55
  Bottom 0.254: v24.23,73.38 24.23,69.72 21.26,66.75 v21.26,61.72 | v70.64,23.55 70.64,26.75 v71.55,27.66 | v74.3,26.06 80.24,32 80.47,32 82.98,34.52 82.98,36.8 86.18,40.01 86.18,60.81 v85.27,61.72 | v83.67,71.55 83.67,72.92 78.87,77.72 50.06,77.72 44.35,72.01 v34.98,72.01
A22  (via drill 0.61)
  Top 0.254: v67.89,27.2 67.89,25.38 IC4.15 | v25.38,13.95 20.57,13.95 v19.89,14.63
  Bottom 0.254: v67.89,27.2 67.44,27.2 59.66,19.43 54.86,19.43 48.92,13.49 42.29,13.49 38.41,9.6 29.72,9.6 v25.38,13.95 | v19.89,14.63 16.46,11.2 16.46,7.32 18.52,5.26 20.57,5.26 21.49,6.17 JP2.48
A23  (via drill 0.61)
  Top 0.254: v38.63,50.29 40.01,50.29 41.38,48.92 43.89,48.92 IC6.4 | v18.52,16 21.95,19.43 v25.38,19.43 25.6,19.2 v27.43,19.2 | v15.54,13.72 20.34,8.91 20.34,5.03 21.49,3.89 JP2.47 | v65.38,23.55 65.38,25.15 IC4.17 | v45.72,12.12 45.72,13.72 v40.23,19.2
  Bottom 0.254: v38.63,50.29 32.92,50.29 32,49.38 31.32,49.38 30.4,48.46 30.4,47.78 29.49,46.86 28.8,46.86 25.38,43.43 v25.38,19.43 | v18.52,16 17.83,16 v15.54,13.72 | v65.38,23.55 64.69,23.55 60.12,18.97 58.06,18.97 57.38,18.29 57.38,13.95 58.98,12.34 58.98,11.43 58.52,10.97 56.69,10.97 55.09,12.57 46.18,12.57 v45.72,12.12 | v27.43,19.2 v40.23,19.2
CE0N  (via drill 0.61)
  Top 0.254: IC6.15 51.44,51.44 v51.89,50.98 | v41.15,44.12 40.46,44.12 v38.41,42.06 | v36.35,40.01 36.35,36.35 34.75,34.75 34.75,31.77 32,29.03 28.57,29.03 26.29,26.75 26.29,24.23 29.03,21.49 29.72,21.49 30.4,20.8 30.4,18.97 JP1.6
  Bottom 0.254: v51.89,50.98 51.89,48.46 48.69,45.26 46.18,45.26 44.12,47.32 40.69,47.32 39.78,46.41 39.78,45.49 v41.15,44.12 | v36.35,40.01 v38.41,42.06
CE1N  (via drill 0.61)
  Top 0.254: v52.81,50.06 50.06,50.06 IC6.14 | v44.81,39.09 v48.46,42.75 | v38.63,38.63 38.63,37.26 35.2,33.83 35.2,24.92 33.15,22.86 JP1.9
  Bottom 0.254: v52.81,50.06 52.81,47.09 v48.46,42.75 | v44.81,39.09 39.09,39.09 v38.63,38.63
CE2N  (via drill 0.61)
  Top 0.254: v45.49,27.66 52.35,34.52 52.35,41.15 52.58,41.38 52.58,47.09 50.98,48.69 50.06,48.69 IC6.13
  Bottom 0.254: v45.49,27.66 33.83,27.66 31.77,25.6 JP1.11
CE3N  (via drill 0.61)
  Top 0.254: v47.78,47.78 50.06,47.78 IC6.12
  Bottom 0.254: v47.78,47.78 42.52,47.78 40.92,49.38 34.98,49.38 33.38,47.78 33.38,42.29 31.77,40.69 JP1.23
CE4N  (via drill 0.61)
  Top 0.254: v51.66,42.98 51.66,45.49 50.98,46.18 50.06,46.18 IC6.11 | v48.01,56.69 v52.35,52.35 | v39.55,56.69 38.86,56.69 37.95,57.61 37.95,57.84 33.38,62.41 30.18,62.41 29.26,63.32 JP1.41
  Bottom 0.254: v51.66,42.98 51.66,45.26 53.72,47.32 53.72,50.98 v52.35,52.35 | v39.55,56.69 v48.01,56.69
CE5N  (via drill 0.61)
  Top 0.254: v48.23,46.18 49.15,45.26 50.06,45.26 IC6.10 | v39.55,51.44 34.29,56.69 32.69,56.69 32.23,57.15 30.4,57.15 29.26,58.29 JP1.38
  Bottom 0.254: v48.23,46.18 48.23,46.86 48.69,47.32 48.69,48.23 47.55,49.38 41.6,49.38 v39.55,51.44
CE6N  (via drill 0.61)
  Top 0.254: v47.78,43.89 50.06,43.89 IC6.9 | v40.69,45.95 37.26,45.95 33.38,49.84 v33.38,53.26
  Bottom 0.254: v47.78,43.89 46.86,43.89 43.89,46.86 41.6,46.86 v40.69,45.95 | v33.38,53.26 32,54.63 30.4,54.63 29.26,55.78 JP1.36
CE7N  (via drill 0.61)
  Top 0.254: v37.49,42.98 39.55,45.03 43.89,45.03 IC6.7 | v36.12,41.6 34.06,39.55 30.18,39.55 29.26,40.46 JP1.24
  Bottom 0.254: v36.12,41.6 v37.49,42.98
D0  (via drill 0.61)
  Top 0.254: v42.98,21.72 42.98,21.03 48.92,15.09 48.92,11.66 48.46,11.2 48.46,10.29 46.41,8.23 46.41,7.32 45.72,6.63 45.72,5.94 45.03,5.26 42.98,5.26 42.06,6.17 JP2.31 | v52.12,67.89 48.92,67.89 IC11.13 | v73.15,69.72 73.15,69.04 75.44,66.75 v75.44,62.87 | v79.32,53.03 79.32,51.44 77.5,49.61 IC2.11 77.27,49.38 75.67,47.78 75.67,43.89 74.3,42.52 67.89,42.52 67.44,42.98 65.61,42.98 64.92,42.29 64.92,41.6 65.38,41.15 v65.38,38.41 | v40.69,23.77 40.69,25.6 46.63,31.55 v46.63,32
  Bottom 0.254: 40.69,24 31.55,24 30.63,24.92 30.63,25.83 31.55,26.75 31.55,27.89 JP1.13 | v42.98,21.72 40.69,24 | v52.12,67.89 52.81,67.89 53.03,67.67 71.09,67.67 v73.15,69.72 | v75.44,62.87 75.89,62.87 76.35,63.32 78.64,63.32 79.32,62.64 v79.32,53.03 | v40.69,23.77 40.69,24 | v46.63,32 47.32,32 48.46,33.15 56.46,33.15 58.75,35.43 58.75,35.66 59.66,36.58 63.55,36.58 v65.38,38.41
D1  (via drill 0.61)
  Top 0.254: v68.35,43.43 v73.84,43.43 | v56.92,36.35 56.92,34.98 v56.46,34.52 | v22.63,12.12 24.46,10.29 34.52,10.29 38.41,6.4 39.32,6.4 JP2.33 | v21.49,22.86 29.03,30.4 JP1.16
  Bottom 0.254: v73.84,43.43 77.27,46.86 IC2.12 | v68.35,43.43 68.35,42.06 66.06,39.78 62.87,39.78 60.58,37.49 58.06,37.49 v56.92,36.35 | v56.46,34.52 54.63,34.52 54.18,34.98 48.01,34.98 46.41,33.38 42.06,33.38 41.83,33.15 35.89,33.15 34.29,34.75 33.38,34.75 32.92,34.29 32.92,32.46 32.23,31.77 30.4,31.77 29.26,30.63 JP1.16 | v22.63,12.12 22.63,12.8 22.4,13.03 22.4,15.54 21.49,16.46 v21.49,22.86
D2  (via drill 0.61)
  Top 0.254: v33.83,33.83 33.83,35.89 31.77,37.95 JP1.21 | v41.15,10.97 41.15,16.23 37.49,19.89 37.49,23.09 41.15,26.75 v41.15,31.09
  Bottom 0.254: v33.83,33.83 34.52,33.83 37.26,31.09 v41.15,31.09 47.09,31.09 48.69,32.69 62.41,32.69 69.72,40.01 71.78,40.01 76.12,44.35 77.27,44.35 IC2.13 | v41.15,10.97 37.03,6.86 37.03,6.4 JP2.35
D3  (via drill 0.61)
  Top 0.254: v83.9,44.81 86.64,42.06 92.58,42.06 IC2.15 | v50.52,25.83 50.52,20.57 53.03,18.06 v53.03,11.2 | v33.83,32.46 32.92,33.38 32.92,33.6 32.23,34.29 31.32,34.29 30.63,34.98 30.63,35.89 29.26,37.26 29.26,37.95 JP1.22 | v38.41,32.23 v36.58,30.4 | v53.72,34.06 53.72,31.77 v54.86,30.63
  Bottom 0.254: v83.9,44.81 83.21,44.81 77.95,39.55 70.18,39.55 61.49,30.86 55.55,30.86 55.09,30.4 | v50.52,25.83 55.09,30.4 | v53.03,11.2 48.23,11.2 46.41,9.37 40.46,9.37 37.95,6.86 37.95,5.71 37.49,5.26 35.2,5.26 34.29,6.17 JP2.37 | v33.83,32.46 34.52,32.46 v36.58,30.4 | v38.41,32.23 45.49,32.23 46.18,32.92 47.55,32.92 48.69,34.06 v53.72,34.06 | 55.09,30.4 v54.86,30.63
D4  (via drill 0.61)
  Top 0.254: v85.72,65.38 85.72,66.75 78.64,73.84 74.52,73.84 70.18,78.18 41.83,78.18 v40.92,77.27 | v44.35,73.38 45.95,71.78 45.95,66.52 v46.18,66.29 | v27.66,56.01 27.66,54.86 29.03,53.49 JP1.34
  Bottom 0.254: v85.72,65.38 88.01,63.09 88.47,63.09 90.75,60.81 90.75,59.44 91.67,58.52 93.5,58.52 94.41,57.61 94.41,46.18 92.81,44.58 IC2.16 | v40.92,77.27 40.92,76.81 v44.35,73.38 | v46.18,66.29 41.38,66.29 32.23,57.15 28.8,57.15 v27.66,56.01 | JP2.39 31.55,6.4 24.46,13.49 24.46,48.69 26.75,50.98 26.75,53.03 27.2,53.49 29.03,53.49 JP1.34
D5  (via drill 0.61)
  Top 0.254: v96.7,50.98 IC2.17 | v28.12,52.12 27.2,53.03 | 27.2,53.03 v22.86,57.38 | v24,49.61 27.2,52.81 27.2,53.03
  Bottom 0.254: v96.7,50.98 96.7,52.12 98.07,53.49 98.07,69.27 93.5,73.84 83.44,73.84 79.1,78.18 49.84,78.18 47.09,75.44 46.18,75.44 42.98,78.64 27.89,78.64 25.15,75.89 25.15,69.95 23.55,68.35 23.55,64.24 22.17,62.87 22.17,61.27 21.72,60.81 21.72,58.52 v22.86,57.38 | v28.12,52.12 30.4,52.12 31.55,50.98 JP1.31 | v24,49.61 24,13.26 28.12,9.14 28.12,5.71 29.03,4.8 29.03,3.89 JP2.41
D6  (via drill 0.61)
  Top 0.254: v96.7,53.49 92.81,49.61 IC2.18 | v94.87,67.44 94.87,74.98 92.13,77.72 v80.92,77.72 | v43.89,76.35 v46.63,76.35 | v22.17,56.01 v22.17,50.06 29.03,43.2 JP1.26
  Bottom 0.254: v96.7,53.49 96.7,54.63 97.61,55.55 97.61,64.69 v94.87,67.44 | v80.92,77.72 80.24,77.72 79.32,78.64 48.92,78.64 v46.63,76.35 | v43.89,76.35 43.2,76.35 41.38,78.18 28.12,78.18 25.83,75.89 25.83,58.98 22.86,56.01 v22.17,56.01 | v22.17,50.06 16,43.89 16,40.01 11.89,35.89 11.89,10.52 14.17,8.23 14.17,5.71 17.37,2.52 24.46,2.52 25.6,3.66 26.52,3.66 JP2.43
D7  (via drill 0.61)
  Top 0.254: v96.7,56.01 92.81,52.12 IC2.19 | v90.75,66.52 90.75,67.21 v86.41,71.55 | v27.89,69.72 26.29,69.72 v24.92,68.35 | v24.92,60.81 21.26,57.15 21.26,49.38 28.57,42.06 | 28.57,42.06 30.63,42.06 JP1.25 | v15.09,7.32 15.09,4.8 17.83,2.06 22.4,2.06 24,3.66 JP2.45 | 28.57,42.06 v23.09,36.58
  Bottom 0.254: v96.7,56.01 96.7,63.55 93.95,66.29 90.98,66.29 v90.75,66.52 | v86.41,71.55 85.04,71.55 83.9,70.41 80.24,70.41 78.18,68.35 74.75,68.35 72.01,65.61 50.75,65.61 46.63,69.72 v27.89,69.72 | v24.92,60.81 v24.92,68.35 | v15.09,7.32 15.09,8 12.34,10.74 12.34,25.83 v23.09,36.58
G259N
  Top 0.254: IC11.14 48.92,69.27 51.44,69.27 56.24,74.07 59.66,74.07 63.55,70.18 68.12,70.18 68.35,70.41 IC1.19
GND  (via drill 0.61)
  Top 0.254: JP2.49 19.2,3.89 19.2,6.17 JP2.50 | v35.66,16 35.66,15.09 44.35,6.4 JP2.29 | v21.49,14.86 27.2,14.86 29.03,16.69 30.63,16.69 31.55,17.6 JP1.5 | JP3.2 6.4,76.35 8.69,76.35 JP3.3 8.91,76.12 18.06,66.98 | 18.06,66.98 26.52,66.98 28.57,64.92 29.49,64.92 30.86,63.55 31.55,63.55 JP1.42 | v74.07,13.03 73.15,13.95 73.15,15.09 IC4.10 | v59.89,13.26 61.72,15.09 IC4.1 61.49,15.32 61.49,18.29 58.52,21.26 58.52,22.86 C6.2 58.29,22.86 58.29,30.86 57.84,31.32 57.84,43.2 | 76.35,40.92 76.35,38.18 C5.2 76.12,37.95 75.21,37.03 75.21,32 77.27,29.95 77.27,6.4 JP2.3 | 76.35,40.92 77.27,41.83 IC2.14 | 76.35,40.92 75.44,41.83 66.06,41.83 C4.2 | IC1.10 58.52,60.12 64.24,60.12 65.84,58.52 C2.2 | v45.72,43.66 44.12,43.66 IC6.8 | 63.32,44.58 63.78,45.03 63.78,47.32 65.61,49.15 | 63.32,44.58 63.09,44.35 60.58,44.35 IC12.7 60.35,44.35 59.21,43.2 57.84,43.2 | 65.61,49.15 65.84,49.38 66.52,49.38 IC12.12 66.52,49.61 66.52,50.75 IC12.13 | 65.61,49.15 61.95,52.81 60.35,52.81 53.49,59.66 48.46,59.66 C1.2 48.23,59.89 47.32,59.89 44.35,62.87 IC11.8 40.46,62.87 37.72,65.61 v37.72,66.06 | 63.32,44.58 v63.55,44.35 | 57.84,43.2 v57.61,43.2 | v13.72,18.97 13.72,19.66 11.89,21.49 11.89,60.81 18.06,66.98
  Bottom 0.254: v35.66,16 33.38,16 31.77,17.6 JP1.5 31.55,17.6 30.63,16.69 28.57,16.69 26.29,18.97 26.29,25.38 | 26.29,25.38 26.29,41.83 29.03,44.58 29.03,45.72 JP1.28 | 26.29,25.38 27.66,25.38 28.12,25.83 28.12,31.09 28.8,31.77 29.72,31.77 30.4,32.46 30.4,33.38 31.55,34.52 31.55,35.43 JP1.19 | 21.26,14.63 16.92,10.29 16.92,7.77 18.29,6.4 18.97,6.4 JP2.50 | 77.27,9.83 v74.07,13.03 | 77.27,9.83 77.27,6.4 JP2.3 | C7.2 84.12,11.43 82.53,9.83 77.27,9.83 | v59.89,13.26 59.89,6.4 JP2.17 | v45.72,43.66 46.18,43.66 49.38,40.46 C3.2 49.61,40.69 51.66,40.69 54.18,43.2 v57.61,43.2 | C1.2 50.52,61.95 71.32,61.95 71.78,61.49 71.78,60.58 71.32,60.12 69.04,60.12 67.44,58.52 66.06,58.52 C2.2 | v63.55,44.35 65.84,42.06 C4.2 | v37.72,66.06 35.2,63.55 31.77,63.55 JP1.42 | 21.26,14.63 16.92,18.97 v13.72,18.97 | 21.26,14.63 v21.49,14.86
IOSELN  (1 unrouted)
N$1  (via drill 0.61)
  Top 0.254: 66.52,16 65.84,16.69 64.92,16.69 64.24,16 64.24,15.32 IC4.3 | 66.52,16 66.52,15.32 IC4.5 66.52,16 | 69.04,16.23 69.04,15.32 IC4.7 69.04,16.23 | 68.58,16.69 69.04,16.23 | 68.58,16.69 67.21,16.69 66.52,16 | 69.04,16.23 69.49,16.69 71.09,16.69 71.55,16.23 71.55,15.32 IC4.9 | 65.84,26.75 64.92,26.75 64.24,26.06 64.24,25.38 IC4.18 | 65.84,26.75 66.52,26.06 66.52,25.38 IC4.16 | v68.35,47.09 68.35,52.12 67.67,52.81 67.44,52.81 62.87,57.38 56.46,57.38 53.03,60.81 47.09,60.81 45.26,62.64 45.26,66.06 43.43,67.89 42.75,67.89 IC11.4 | v69.27,40.92 69.72,40.92 72.47,38.18 72.47,35.66 v71.32,34.52 | 69.27,26.75 69.27,25.38 IC4.14 69.04,25.15 69.04,24.46 68.58,24 68.58,16.69 | 69.27,26.75 69.27,28.12 | 69.27,28.12 v69.27,33.15 | 69.27,26.75 71.09,26.75 71.55,26.29 71.55,25.38 IC4.12 | 65.84,26.75 67.21,28.12 69.27,28.12
  Bottom 0.254: v68.35,47.09 69.27,46.18 v69.27,40.92 | v71.32,34.52 70.64,34.52 v69.27,33.15
N$2
  Top 0.254: R2.1 87.78,33.15 95.33,33.15 96.47,34.29 LED1.K
N$3  (via drill 0.61)
  Top 0.254: v52.58,66.52 48.92,66.52 IC11.12 | v65.84,63.32 v62.64,66.52 | v90.3,51.21 89.61,51.21 85.5,47.09 82.07,47.09 80.01,45.03 R2.2
  Bottom 0.254: v62.64,66.52 v52.58,66.52 | v65.84,63.32 71.78,63.32 74.07,65.61 76.12,65.61 76.35,65.84 83.9,65.84 90.3,59.44 v90.3,51.21
N$4  (via drill 0.61)
  Top 0.254: IC12.6 62.18,45.72 v62.64,45.26 | v60.12,38.41 60.12,36.12 60.58,35.66 60.58,31.32 61.95,29.95 61.95,28.35 60.81,27.2 60.81,19.66 62.87,17.6 IC4.2
  Bottom 0.254: v62.64,45.26 62.64,41.6 62.87,41.38 62.87,40.46 60.81,38.41 v60.12,38.41
PH2  (via drill 0.61)
  Top 0.254: v64.69,45.95 65.61,46.86 66.52,46.86 IC12.10 | v63.55,42.06 62.87,42.06 61.95,42.98 60.58,42.98 59.21,41.6 59.21,35.66 v59.66,35.2 | v63.55,35.2 68.58,35.2 70.18,33.6 70.18,32.69 69.72,32.23 69.72,31.32 74.07,26.98 74.75,26.98 76.35,25.38 76.35,10.06 v75.89,9.6
  Bottom 0.254: v64.69,45.95 64.69,44.81 67.21,42.29 67.21,41.6 66.52,40.92 64.69,40.92 v63.55,42.06 | v63.55,35.2 v59.66,35.2 | v75.89,9.6 75.89,7.09 76.35,6.63 76.35,5.71 76.81,5.26 79.1,5.26 80.01,6.17 JP2.1
PU1  (via drill 0.61)
  Top 0.254: 69.27,64.01 69.95,63.32 69.95,62.41 69.27,61.72 68.58,61.72 IC1.12 68.35,61.72 60.58,61.72 59.89,62.41 | 69.27,64.01 68.58,64.01 IC1.14 69.27,64.01 | 69.27,66.52 68.58,66.52 IC1.16 69.27,66.52 | 69.27,66.52 69.95,65.84 69.95,64.69 69.27,64.01 | 69.95,68.35 69.27,69.04 68.58,69.04 IC1.18 | 69.95,68.35 69.95,67.21 69.27,66.52 | 69.95,68.35 v70.41,68.81 | IC1.3 58.52,69.04 59.21,69.04 59.89,68.35 59.89,67.44 59.21,66.75 58.52,66.75 IC1.5 58.29,66.52 57.61,66.52 56.92,65.84 56.92,64.92 57.61,64.24 58.29,64.24 IC1.7 58.52,64.01 59.21,64.01 59.89,63.32 59.89,62.41 | v56.69,59.89 56.69,60.58 57.61,61.49 58.29,61.49 IC1.9 58.52,61.72 59.21,61.72 59.89,62.41 | IC6.6 44.12,46.41 44.58,46.41 46.41,48.23 46.41,49.61 v47.78,50.98 47.78,51.66 42.06,57.38 42.06,60.12 42.75,60.81 45.26,60.81 53.72,52.35 53.72,49.61 53.03,48.92 53.03,41.15 52.81,40.92 52.81,33.6 42.06,22.86 42.06,21.26 46.86,16.46 46.86,11.43 R1.1
  Bottom 0.254: v70.41,68.81 76.35,74.75 77.27,74.75 IC2.1 | v56.69,59.89 v47.78,50.98
RAMOEN  (via drill 0.61)
  Top 0.254: v54.41,42.06 56.69,44.35 56.69,51.21 57.38,51.89 58.29,51.89 58.75,51.44 58.75,50.52 59.66,49.61 60.35,49.61 IC12.3 | v46.18,34.52 v48.01,36.35 | v34.29,44.81 32.23,46.86 31.55,46.86 30.18,48.23 29.26,48.23 JP1.30
  Bottom 0.254: v54.41,42.06 53.72,42.06 v48.01,36.35 | v46.18,34.52 42.52,34.52 41.6,33.6 36.12,33.6 34.52,35.2 33.83,35.2 | 33.83,35.2 33.15,35.2 31.77,33.83 31.77,33.15 JP1.17 | v34.29,44.81 34.29,42.75 33.83,42.29 33.83,35.2
RASN  (via drill 0.61)
  Top 0.254: v40.46,48.46 41.15,47.78 43.89,47.78 IC6.5 | v40.23,42.29 40.23,37.03 39.32,36.12 39.32,25.6 36.58,22.86 36.58,18.29 34.75,16.46 34.75,14.63 v40.92,8.46
  Bottom 0.254: v40.46,48.46 40.46,47.78 39.32,46.63 39.32,43.2 v40.23,42.29 | v40.92,8.46 44.58,8.46 45.03,8.91 52.35,8.91 54.41,6.86 54.41,6.4 JP2.21
RESN  (via drill 0.61)
  Top 0.254: v50.98,70.64 48.92,70.64 IC11.15 | v84.35,74.98 v79.55,74.98 | v94.87,17.6 94.87,16.92 80.47,2.52 77.04,2.52 76.12,3.43 76.12,5.03 74.98,6.17 JP2.5
  Bottom 0.254: v50.98,70.64 59.21,70.64 65.38,76.81 77.72,76.81 v79.55,74.98 | v84.35,74.98 90.53,74.98 91.67,76.12 93.73,76.12 98.53,71.32 98.53,18.52 97.61,17.6 v94.87,17.6
ROMN  (via drill 0.61)
  Top 0.254: IC4.19 62.87,27.89 63.32,28.35 63.32,33.38 61.95,34.75 v61.95,40.92 | v62.18,48.69 62.18,49.61 61.04,50.75 60.58,50.75 IC12.2 | v79.1,48.46 86.18,48.46 92.13,54.41 92.58,54.41 IC2.20
  Bottom 0.254: v61.95,40.92 61.95,44.58 61.72,44.81 61.72,48.23 61.95,48.46 | 61.95,48.46 v79.1,48.46 | 61.95,48.46 v62.18,48.69
ROMOEN
  Top 0.254: IC12.8 66.75,44.58 68.58,44.58 75.67,51.66 75.67,57.61 76.58,58.52 87.55,58.52 88.92,59.89 92.58,59.89 IC2.22
RW  (via drill 0.61)
  Top 0.254: v68.35,45.72 IC12.9 65.84,45.72 64.47,44.35 64.47,37.95 66.06,36.35 v69.49,36.35 | v62.87,47.55 62.87,48.01 63.09,48.23 63.09,50.06 61.27,51.89 60.58,51.89 IC12.1 | JP2.27 47.09,6.4 47.09,8.23 49.15,10.29 49.15,11.2 50.52,12.57 v50.52,16.46 49.61,16.46 v44.81,21.26 | v27.2,26.29 27.2,25.83 29.03,24 29.72,24 30.63,23.09 30.63,22.4 31.55,21.49 v34.75,21.49
  Bottom 0.254: JP1.27 31.55,45.72 30.63,44.81 30.63,42.98 29.72,42.06 29.03,42.06 28.12,41.15 28.12,37.49 29.03,36.58 29.03,35.66 JP1.20 29.03,35.43 29.03,34.52 27.2,32.69 v27.2,26.29 | v68.35,45.72 66.29,45.72 64.47,47.55 v62.87,47.55 | v50.52,16.46 51.21,16.46 56.46,21.72 61.27,21.72 66.98,27.43 66.98,33.83 v69.49,36.35 | v34.75,21.49 37.26,21.49 37.95,20.8 44.35,20.8 v44.81,21.26
VCC  (via drill 0.61)
  Top 0.254: 61.04,41.83 61.04,34.98 62.41,33.6 62.41,28.12 61.72,27.43 61.72,25.38 IC4.20 | 61.04,41.83 62.41,41.83 62.87,41.38 62.87,38.86 65.84,35.89 68.58,35.89 69.04,35.43 69.95,35.43 71.09,36.58 71.09,37.95 C5.1 | 61.04,41.83 C4.1 | R1.2 54.63,11.43 54.63,13.95 58.29,17.6 C6.1 | JP2.2 80.01,3.89 82.53,6.4 82.53,11.43 C7.1 82.75,11.43 82.75,29.03 | 82.75,29.03 82.75,29.72 89.84,36.8 96.47,36.8 LED1.A | v76.12,34.75 76.12,34.06 81.15,29.03 82.75,29.03 | v62.18,56.46 IC12.14 | v74.3,75.44 74.3,75.89 75.21,76.81 84.58,76.81 86.41,74.98 92.58,74.98 IC2.28 | 69.04,72.24 68.58,71.78 IC1.20 68.35,71.55 67.67,71.55 66.75,70.64 63.78,70.64 59.89,74.52 56.01,74.52 53.26,71.78 48.92,71.78 IC11.16 48.69,71.55 48.01,71.55 46.86,70.41 v46.86,67.44 | 69.04,72.24 v70.41,73.61 | 69.04,72.24 74.07,67.21 74.07,62.41 69.04,57.38 65.61,57.38 64.69,58.29 61.04,58.29 C2.1 | C1.1 49.84,53.03 | 49.84,53.03 50.06,52.81 IC6.16 | 49.84,53.03 48.69,51.89 48.69,50.52 46.86,48.69 46.86,43.43 44.58,41.15 44.58,40.69 C3.1 44.35,40.46 43.2,39.32 | v40.23,29.03 40.23,36.35 43.2,39.32 | v27.89,57.61 28.35,57.15 29.49,57.15 30.63,56.01 31.55,56.01 JP1.35 | v51.44,36.58 51.44,37.49 50.75,38.18 44.35,38.18 43.2,39.32
  Bottom 0.254: 64.69,5.49 64.69,6.17 JP2.13 | 64.69,5.49 63.32,4.12 63.32,3.2 62.18,2.06 57.15,2.06 55.78,3.43 55.78,10.29 54.63,11.43 R1.2 | 64.69,5.49 66.06,4.12 66.06,3.43 66.98,2.52 70.18,2.52 71.09,3.43 71.09,4.12 72.01,5.03 75.44,5.03 76.35,4.12 76.35,3.2 77.04,2.52 78.87,2.52 80.01,3.66 JP2.2 | v76.12,34.75 72.92,37.95 71.32,37.95 C5.1 | v62.18,56.46 62.18,57.15 61.04,58.29 C2.1 | v74.3,75.44 72.24,75.44 v70.41,73.61 | v40.23,29.03 31.09,29.03 30.63,28.57 30.63,27.66 29.26,26.29 29.26,25.6 JP1.12 | 46.63,67.21 41.6,67.21 34.06,59.66 28.8,59.66 27.89,58.75 v27.89,57.61 25.15,57.61 21.49,53.95 17.6,53.95 3.89,67.67 3.89,76.12 JP3.1 | 46.63,67.21 47.55,66.29 47.55,62.18 45.26,59.89 43.2,59.89 C1.1 | 46.63,67.21 v46.86,67.44 | v51.44,36.58 53.03,36.58 58.29,41.83 60.81,41.83 C4.1
VDD
  Bottom 0.254: 73.61,26.75 73.66,26.67